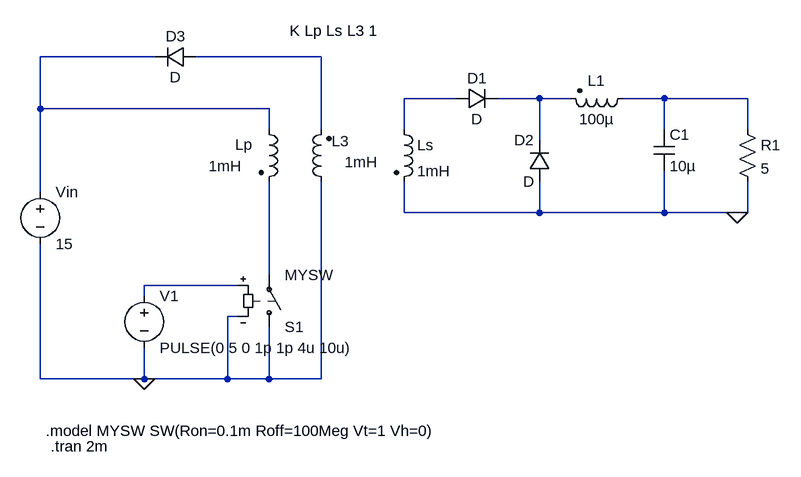
[diagram p0: schematic forward.asc]
forward.asc, the LTspice schematic file:
Version 4
SHEET 1 880 680
WIRE -496 48 -672 48
WIRE -240 48 -432 48
WIRE -32 112 -112 112
WIRE 96 112 32 112
WIRE 144 112 96 112
WIRE 288 112 224 112
WIRE 416 112 288 112
WIRE -672 128 -672 48
WIRE -320 128 -672 128
WIRE -320 160 -320 128
WIRE -240 160 -240 48
WIRE -112 160 -112 112
WIRE 288 160 288 112
WIRE 416 160 416 112
WIRE 96 176 96 112
WIRE -672 256 -672 128
WIRE -112 288 -112 240
WIRE 96 288 96 240
WIRE 96 288 -112 288
WIRE 288 288 288 224
WIRE 288 288 96 288
WIRE 400 288 288 288
WIRE 416 288 416 240
WIRE 416 288 400 288
WIRE -320 384 -320 240
WIRE -368 400 -512 400
WIRE -512 416 -512 400
WIRE -368 448 -384 448
WIRE -672 544 -672 336
WIRE -512 544 -512 496
WIRE -512 544 -672 544
WIRE -384 544 -384 448
WIRE -384 544 -512 544
WIRE -320 544 -320 464
WIRE -320 544 -384 544
WIRE -240 544 -240 240
WIRE -240 544 -320 544
FLAG -512 544 0
FLAG 400 288 0
SYMBOL ind2 -336 144 R0
WINDOW 0 -36 39 Left 2
WINDOW 3 -77 72 Left 2
SYMATTR InstName Lp
SYMATTR Value 1mH
SYMATTR Type ind
SYMATTR SpiceLine Rser=0.1
SYMBOL ind2 -224 256 R180
WINDOW 0 -27 78 Left 2
WINDOW 3 -71 46 Left 2
SYMATTR InstName L3
SYMATTR Value 1mH
SYMATTR Type ind
SYMATTR SpiceLine Rser=0.1
SYMBOL sw -320 480 M180
SYMATTR InstName S1
SYMATTR Value MYSW
SYMBOL ind2 -128 144 R0
SYMATTR InstName Ls
SYMATTR Value 1mH
SYMATTR Type ind
SYMATTR SpiceLine Rser=0.1
SYMBOL voltage -672 240 R0
WINDOW 123 0 0 Left 0
WINDOW 39 0 0 Left 0
SYMATTR InstName Vin
SYMATTR Value 15
SYMBOL diode -32 128 R270
WINDOW 0 32 32 VTop 2
WINDOW 3 0 32 VBottom 2
SYMATTR InstName D1
SYMBOL diode 112 240 R180
WINDOW 0 24 64 Left 2
WINDOW 3 24 0 Left 2
SYMATTR InstName D2
SYMBOL ind2 240 96 R90
WINDOW 0 4 56 VBottom 2
WINDOW 3 32 56 VTop 2
SYMATTR InstName L1
SYMATTR Value 100µ
SYMATTR Type ind
SYMBOL cap 272 160 R0
SYMATTR InstName C1
SYMATTR Value 10µ
SYMBOL res 400 144 R0
SYMATTR InstName R1
SYMATTR Value 5
SYMBOL diode -432 32 R90
WINDOW 0 0 32 VBottom 2
WINDOW 3 32 32 VTop 2
SYMATTR InstName D3
SYMBOL voltage -512 400 R0
WINDOW 123 0 0 Left 0
WINDOW 39 0 0 Left 0
SYMATTR InstName V1
SYMATTR Value PULSE(0 5 0 1p 1p 4u 10u)
TEXT -288 8 Left 2 !K Lp Ls L3 1
TEXT -664 624 Left 2 !.model MYSW SW(Ron=0.1m Roff=100Meg Vt=1 Vh=0)
TEXT -656 648 Left 2 !.tran 2m

The netlist it stands for:
* forward.asc
Lp N001 N006 1mH Rser=0.1
L3 0 N002 1mH Rser=0.1
S1 0 N006 N007 0 MYSW
Ls N003 0 1mH Rser=0.1
Vin N001 0 15
D1 N003 N004 D
D2 0 N004 D
L1 N005 N004 100µ
C1 N005 0 10µ
R1 N005 0 5
D3 N002 N001 D
V1 N007 0 PULSE(0 5 0 1p 1p 4u 10u)
.model D D
.lib standard.dio
K Lp Ls L3 1
.model MYSW SW(Ron=0.1m Roff=100Meg Vt=1 Vh=0)
.tran 2m
.backanno
.end